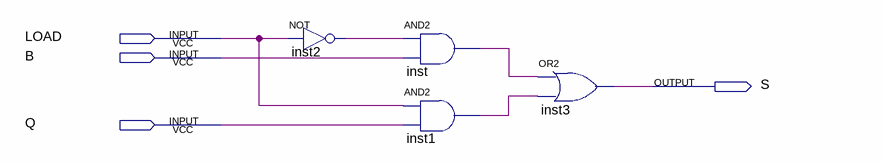
[diagram p0: schematic sheet]
// Quartus schematic moduloCarregador.bdf as structural Verilog: 4 symbols, 4 pins
module moduloCarregador (
  input  LOAD,
  input  B,
  input  Q,
  output S
);

  wire inst1_out, inst2_out, inst_out;

  not inst2 (inst2_out, LOAD);
  and inst (inst_out, inst2_out, B);
  and inst1 (inst1_out, LOAD, Q);
  or inst3 (S, inst_out, inst1_out);
endmodule
